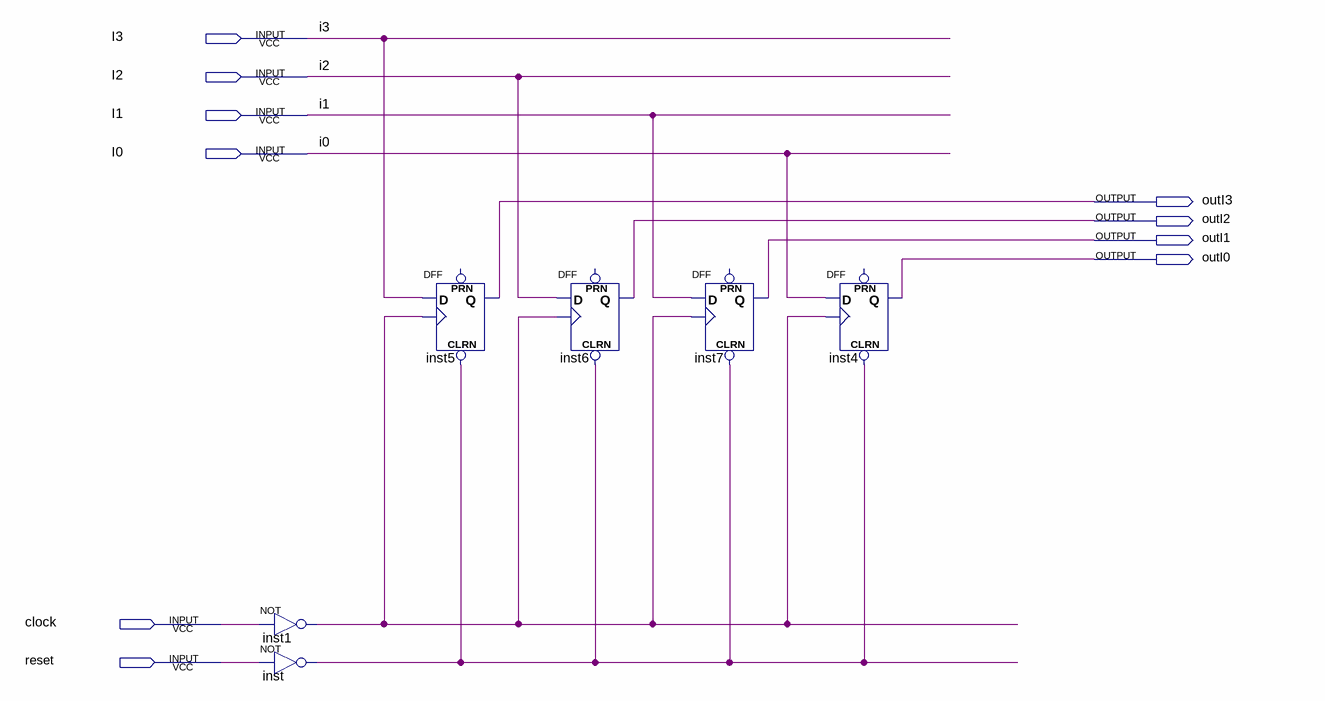
[diagram p0: schematic sheet]
// Quartus schematic register.bdf as structural Verilog: 6 symbols, 10 pins
module register (
  input  I3,
  input  I2,
  input  I1,
  input  I0,
  input  clock,
  input  reset,
  output outI3,
  output outI2,
  output outI1,
  output outI0
);

  wire inst1_out, inst_out;

  not inst1 (inst1_out, clock);
  not inst (inst_out, reset);
  DFF inst5 (.CLRN(inst_out), .CLK(inst1_out), .D(I3), .Q(outI3));  // open: PRN
  DFF inst6 (.CLRN(inst_out), .CLK(inst1_out), .D(I2), .Q(outI2));  // open: PRN
  DFF inst7 (.CLRN(inst_out), .CLK(inst1_out), .D(I1), .Q(outI1));  // open: PRN
  DFF inst4 (.CLRN(inst_out), .CLK(inst1_out), .D(I0), .Q(outI0));  // open: PRN
endmodule
